# Altium project GL3520 4 Ports.PrjPcb
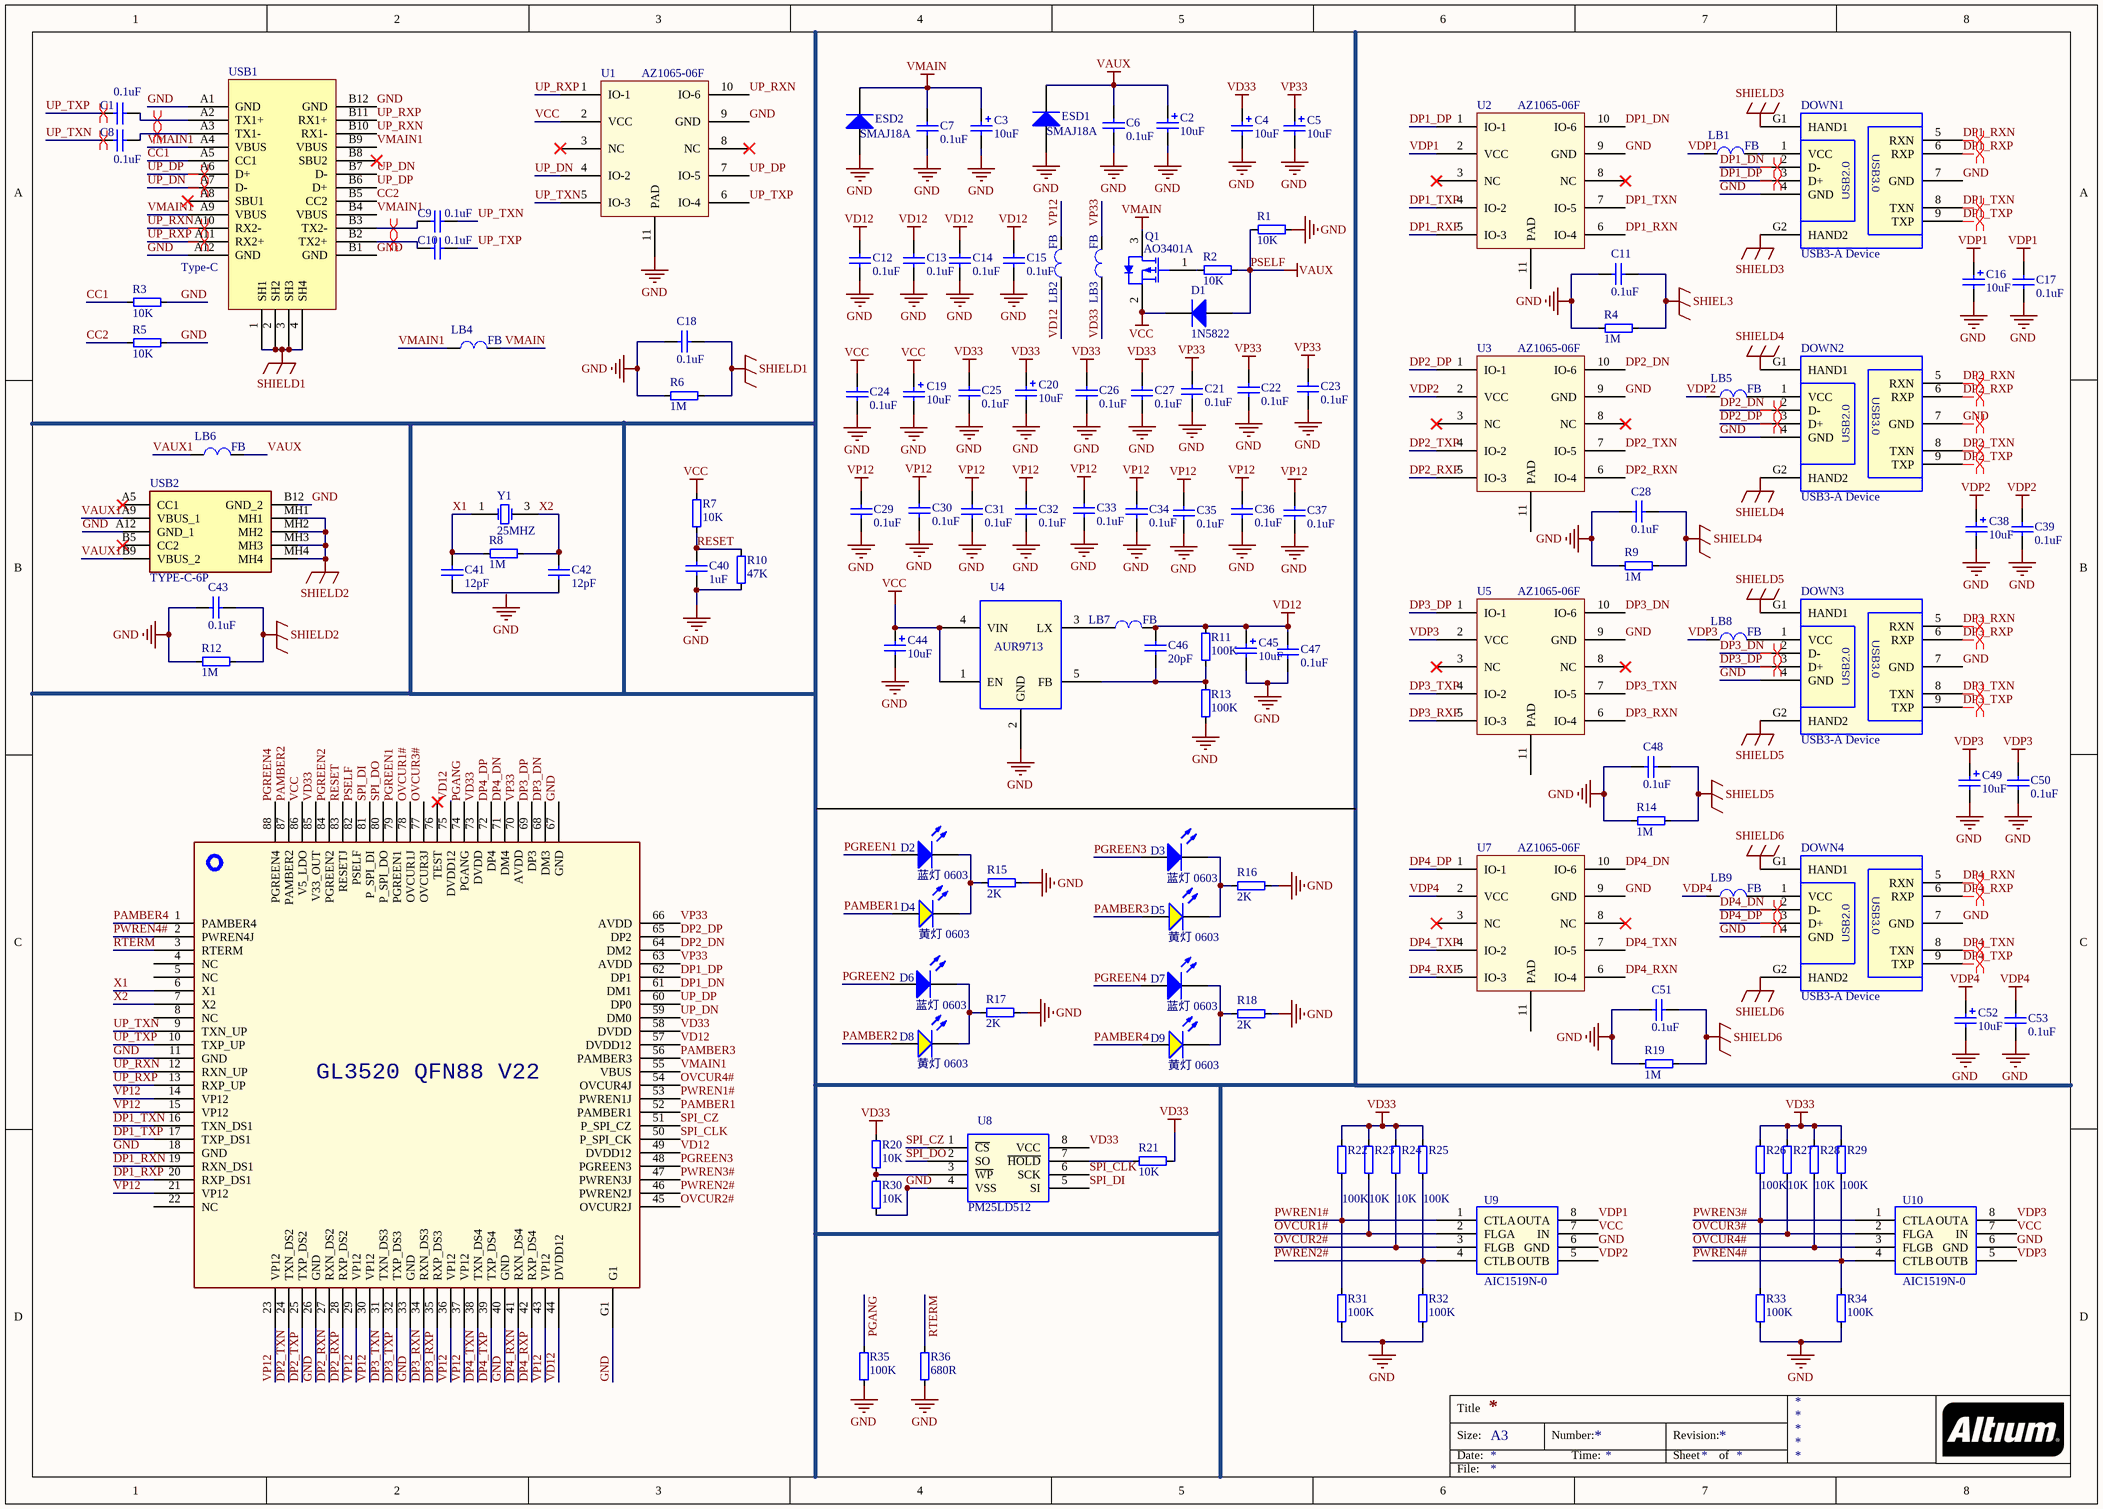
[diagram p0: GL3520 4 Ports.SchDoc]
1 sheet, 127 parts. Net scope: global (net labels, ports and power ports of the same name join across sheets).

## Sheet GL3520 4 Ports.SchDoc
size A3

### Parts
C1  0.1uF  [0603_C]
C2  10uF  [CASE-A_3216]
C3  10uF  [CASE-A_3216]
C4  10uF  [CASE-A_3216]
C5  10uF  [CASE-A_3216]
C6  0.1uF  [0603_C]
C7  0.1uF  [0603_C]
C8  0.1uF  [0603_C]
C9  0.1uF  [0603_C]
C10  0.1uF  [0603_C]
C11  0.1uF  [0603_C]
C12  0.1uF  [0603_C]
C13  0.1uF  [0603_C]
C14  0.1uF  [0603_C]
C15  0.1uF  [0603_C]
C16  10uF  [CASE-A_3216]
C17  0.1uF  [0603_C]
C18  0.1uF  [0603_C]
C19  10uF  [CASE-A_3216]
C20  10uF  [CASE-A_3216]
C21  0.1uF  [0603_C]
C22  0.1uF  [0603_C]
C23  0.1uF  [0603_C]
C24  0.1uF  [0603_C]
C25  0.1uF  [0603_C]
C26  0.1uF  [0603_C]
C27  0.1uF  [0603_C]
C28  0.1uF  [0603_C]
C29  0.1uF  [0603_C]
C30  0.1uF  [0603_C]
C31  0.1uF  [0603_C]
C32  0.1uF  [0603_C]
C33  0.1uF  [0603_C]
C34  0.1uF  [0603_C]
C35  0.1uF  [0603_C]
C36  0.1uF  [0603_C]
C37  0.1uF  [0603_C]
C38  10uF  [CASE-A_3216]
C39  0.1uF  [0603_C]
C40  1uF  [0603_C]
C41  12pF  [0603_C]
C42  12pF  [0603_C]
C43  0.1uF  [0603_C]
C44  10uF  [CASE-A_3216]
C45  10uF  [CASE-A_3216]
C46  20pF  [0603_C]
C47  0.1uF  [0603_C]
C48  0.1uF  [0603_C]
C49  10uF  [CASE-A_3216]
C50  0.1uF  [0603_C]
C51  0.1uF  [0603_C]
C52  10uF  [CASE-A_3216]
C53  0.1uF  [0603_C]
D1  1N5822  [DO-201AD]
D2  蓝灯 0603  [0603_LED_S1]
D3  蓝灯 0603  [0603_LED_S1]
D4  黄灯 0603  [0603_LED_S1]
D5  黄灯 0603  [0603_LED_S1]
D6  蓝灯 0603  [0603_LED_S1]
D7  蓝灯 0603  [0603_LED_S1]
D8  黄灯 0603  [0603_LED_S1]
D9  黄灯 0603  [0603_LED_S1]
DOWN1  USB3-A Device  [CND-USB3-A]
DOWN2  USB3-A Device  [CND-USB3-A]
DOWN3  USB3-A Device  [CND-USB3-A]
DOWN4  USB3-A Device  [CND-USB3-A]
ESD1  SMAJ18A  [VISH-DO-214AC-2_M]
ESD2  SMAJ18A  [VISH-DO-214AC-2_M]
LB1  FB  [LBS-0603]
LB2  FB  [LBS-0603]
LB3  FB  [LBS-0603]
LB4  FB  [LBS-0603]
LB5  FB  [LBS-0603]
LB6  FB  [LBS-0603]
LB7  FB  [LBS-0603]
LB8  FB  [LBS-0603]
LB9  FB  [LBS-0603]
Q1  AO3401A  [AO-SOT-23-3L_V]
R1  10K  [R 0603_L]
R2  10K  [R 0603_L]
R3  10K  [R 0603_L]
R4  1M  [R 0603_L]
R5  10K  [R 0603_L]
R6  1M  [R 0603_L]
R7  10K  [R 0603_L]
R8  1M  [R 0603_L]
R9  1M  [R 0603_L]
R10  47K  [R 0603_L]
R11  100K  [R 0603_L]
R12  1M  [R 0603_L]
R13  100K  [R 0603_L]
R14  1M  [R 0603_L]
R15  2K  [R 0603_L]
R16  2K  [R 0603_L]
R17  2K  [R 0603_L]
R18  2K  [R 0603_L]
R19  1M  [R 0603_L]
R20  10K  [R 0603_L]
R21  10K  [R 0603_L]
R22  100K  [R 0603_L]
R23  10K  [R 0603_L]
R24  10K  [R 0603_L]
R25  100K  [R 0603_L]
R26  100K  [R 0603_L]
R27  10K  [R 0603_L]
R28  10K  [R 0603_L]
R29  100K  [R 0603_L]
R30  10K  [R 0603_L]
R31  100K  [R 0603_L]
R32  100K  [R 0603_L]
R33  100K  [R 0603_L]
R34  100K  [R 0603_L]
R35  100K  [R 0603_L]
R36  680R  [R 0603_L]
U1  AZ1065-06F
U2  AZ1065-06F
U3  AZ1065-06F
U4  AUR9713  [I-TSOT23-5P-2_9x1_6x0_95A]
U5  AZ1065-06F
U6  GL3520_QFN88_V094-1_22  [I-LQFP128-0_4A]  (value not drawn)
U7  AZ1065-06F
U8  PM25LD512  [I-SOP8-1_27A]
U9  AIC1519N-0  [I-SOP8-1_27A]
U10  AIC1519N-0  [I-SOP8-1_27A]
USB1  Type-C  [PCBComponent_1]
USB2  TYPE-C-6P  [TYPEC 6P]
Y1  25MHZ  [SMD-3225_4P]

### Nets
GND: C2.2 C3.2 C4.2 C5.2 C6.1 C7.1 C11.1 C12.1 C13.1 C14.1 C15.1 C16.2 C17.1 C18.1 C19.2 C20.2 C21.1 C22.1 C23.1 C24.1 C25.1 C26.1 C27.1 C28.1 C29.1 C30.1 C31.1 C32.1 C33.1 C34.1 C35.1 C36.1 C37.1 C38.2 C39.1 C40.1 C43.1 C44.2 C45.2 C47.1 C48.1 C49.2 C50.1 C51.1 C52.2 C53.1 DOWN1.4(GND) DOWN1.7(GND) DOWN2.4(GND) DOWN2.7(GND) DOWN3.4(GND) DOWN3.7(GND) DOWN4.4(GND) DOWN4.7(GND) ESD1.2(A) ESD2.2(A) R1.2 R3.2 R4.2 R5.2 R6.2 R9.2 R10.1 R12.2 R13.2 R14.2 R15.1 R16.1 R17.1 R18.1 R19.2 R30.2 R31.2 R32.2 R33.2 R34.2 R35.2 R36.2 U1.9(GND) U1.11(PAD) U2.9(GND) U3.9(GND) U4.2(GND) U5.9(GND) U6.11(GND) U6.18(GND) U6.26(GND) U6.33(GND) U6.40(GND) U6.67(GND) U6.G1 U7.9(GND) U8.4(VSS) U9.6(GND) U10.6(GND) USB1.A1(GND) USB1.A12(GND) USB1.B1(GND) USB1.B12(GND) USB2.A12(GND_1) USB2.B12(GND_2)
PSELF: C2.1 C6.2 D1.1(A) ESD1.1(K) LB6.2 R1.1 R2.2 U6.82(PSELF)  [also labelled VAUX]
SHIEL3: C11.2 R4.1
SHIELD1: C18.2 R6.1 USB1.1(SH1) USB1.2(SH2) USB1.3(SH3) USB1.4(SH4)
SHIELD2: C43.2 R12.1 USB2.MH1 USB2.MH2 USB2.MH3 USB2.MH4
SHIELD3: DOWN1.G1(HAND1) DOWN1.G2(HAND2)
SHIELD4: C28.2 DOWN2.G1(HAND1) DOWN2.G2(HAND2) R9.1
SHIELD5: C48.2 DOWN3.G1(HAND1) DOWN3.G2(HAND2) R14.1
SHIELD6: C51.2 DOWN4.G1(HAND1) DOWN4.G2(HAND2) R19.1
VCC: C19.1 C24.2 C44.1 D1.2(K) Q1.2(SOURCE) R7.2 U1.2(VCC) U4.1(EN) U4.4(VIN) U6.86(V5_LDO) U9.7(IN) U10.7(IN)
VD12: C12.2 C13.2 C14.2 C15.2 C45.1 C46.2 C47.2 LB2.1 LB7.2 R11.1 U6.44(DVDD12) U6.49(DVDD12) U6.57(DVDD12) U6.75(DVDD12)
VD33: C4.1 C20.1 C25.2 C26.2 C27.2 LB3.1 R20.1 R21.2 R22.1 R23.1 R24.1 R25.1 R26.1 R27.1 R28.1 R29.1 U6.58(DVDD) U6.73(DVDD) U6.85(V33_OUT) U8.8(VCC)
VDP1: C16.1 C17.2 LB1.1 U2.2(VCC) U9.8(OUTA)
VDP2: C38.1 C39.2 LB5.1 U3.2(VCC) U9.5(OUTB)
VDP3: C49.1 C50.2 LB8.1 U5.2(VCC) U10.5(OUTB) U10.8(OUTA)
VDP4: C52.1 C53.2 LB9.1 U7.2(VCC)
VMAIN: C3.1 C7.2 ESD2.1(K) LB4.2 Q1.3(DRAIN)
VP12: C29.2 C30.2 C31.2 C32.2 C33.2 C34.2 C35.2 C36.2 C37.2 LB2.2 U6.14(VP12) U6.15(VP12) U6.21(VP12) U6.23(VP12) U6.29(VP12) U6.30(VP12) U6.36(VP12) U6.37(VP12) U6.43(VP12)
VP33: C5.1 C21.2 C22.2 C23.2 LB3.2 U6.63(AVDD) U6.66(AVDD) U6.70(AVDD)
CC1: R3.1 USB1.A5(CC1)
CC2: R5.1 USB1.B5(CC2)
DP1_DN: DOWN1.2(D-) U2.10(IO-6) U6.61(DM1)
DP1_DP: DOWN1.3(D+) U2.1(IO-1) U6.62(DP1)
DP1_RXN: DOWN1.5(RXN) U2.6(IO-4) U6.19(RXN_DS1)
DP1_RXP: DOWN1.6(RXP) U2.5(IO-3) U6.20(RXP_DS1)
DP1_TXN: DOWN1.8(TXN) U2.7(IO-5) U6.16(TXN_DS1)
DP1_TXP: DOWN1.9(TXP) U2.4(IO-2) U6.17(TXP_DS1)
DP2_DN: DOWN2.2(D-) U3.10(IO-6) U6.64(DM2)
DP2_DP: DOWN2.3(D+) U3.1(IO-1) U6.65(DP2)
DP2_RXN: DOWN2.5(RXN) U3.6(IO-4) U6.27(RXN_DS2)
DP2_RXP: DOWN2.6(RXP) U3.5(IO-3) U6.28(RXP_DS2)
DP2_TXN: DOWN2.8(TXN) U3.7(IO-5) U6.24(TXN_DS2)
DP2_TXP: DOWN2.9(TXP) U3.4(IO-2) U6.25(TXP_DS2)
DP3_DN: DOWN3.2(D-) U5.10(IO-6) U6.68(DM3)
DP3_DP: DOWN3.3(D+) U5.1(IO-1) U6.69(DP3)
DP3_RXN: DOWN3.5(RXN) U5.6(IO-4) U6.34(RXN_DS3)
DP3_RXP: DOWN3.6(RXP) U5.5(IO-3) U6.35(RXP_DS3)
DP3_TXN: DOWN3.8(TXN) U5.7(IO-5) U6.31(TXN_DS3)
DP3_TXP: DOWN3.9(TXP) U5.4(IO-2) U6.32(TXP_DS3)
DP4_DN: DOWN4.2(D-) U6.71(DM4) U7.10(IO-6)
DP4_DP: DOWN4.3(D+) U6.72(DP4) U7.1(IO-1)
DP4_RXN: DOWN4.5(RXN) U6.41(RXN_DS4) U7.6(IO-4)
DP4_RXP: DOWN4.6(RXP) U6.42(RXP_DS4) U7.5(IO-3)
DP4_TXN: DOWN4.8(TXN) U6.38(TXN_DS4) U7.7(IO-5)
DP4_TXP: DOWN4.9(TXP) U6.39(TXP_DS4) U7.4(IO-2)
OVCUR1#: R23.2 U6.78(OVCUR1J) U9.2(FLGA)
OVCUR2#: R24.2 U6.45(OVCUR2J) U9.3(FLGB)
OVCUR3#: R27.2 U6.77(OVCUR3J) U10.2(FLGA)
OVCUR4#: R28.2 U6.54(OVCUR4J) U10.3(FLGB)
PAMBER1: D4.A U6.52(PAMBER1)
PAMBER2: D8.A U6.87(PAMBER2)
PAMBER3: D5.A U6.56(PAMBER3)
PAMBER4: D9.A U6.1(PAMBER4)
PGANG: R35.1 U6.74(PGANG)
PGREEN1: D2.A U6.79(PGREEN1)
PGREEN2: D6.A U6.84(PGREEN2)
PGREEN3: D3.A U6.48(PGREEN3)
PGREEN4: D7.A U6.88(PGREEN4)
PWREN1#: R22.2 R31.1 U6.53(PWREN1J) U9.1(CTLA)
PWREN2#: R25.2 R32.1 U6.46(PWREN2J) U9.4(CTLB)
PWREN3#: R26.2 R33.1 U6.47(PWREN3J) U10.1(CTLA)
PWREN4#: R29.2 R34.1 U6.2(PWREN4J) U10.4(CTLB)
RESET: C40.2 R7.1 R10.2 U6.83(RESETJ)
RTERM: R36.1 U6.3(RTERM)
SPI_CLK: U6.50(P_SPI_CK) U8.6(SCK)
SPI_CZ: U6.51(P_SPI_CZ) U8.1(~{CS})
SPI_DI: U6.81(P_SPI_DI) U8.5(SI)
SPI_DO: U6.80(P_SPI_DO) U8.2(SO)
UP_DN: U1.4(IO-2) U6.59(DM0) USB1.A7(D-) USB1.B7(D-)
UP_DP: U1.7(IO-5) U6.60(DP0) USB1.A6(D+) USB1.B6(D+)
UP_RXN: U1.10(IO-6) U6.12(RXN_UP) USB1.A10(RX2-) USB1.B10(RX1-)
UP_RXP: U1.1(IO-1) U6.13(RXP_UP) USB1.A11(RX2+) USB1.B11(RX1+)
UP_TXN: C8.2 C9.1 U1.5(IO-3) U6.9(TXN_UP)
UP_TXP: C1.2 C10.1 U1.6(IO-4) U6.10(TXP_UP)
VAUX1: LB6.1 USB2.A9(VBUS_1) USB2.B9(VBUS_2)
VMAIN1: LB4.1 U6.55(VBUS) USB1.A4(VBUS) USB1.A9(VBUS) USB1.B4(VBUS) USB1.B9(VBUS)
X1: C41.2 R8.1 U6.6(X1) Y1.1(OSC1)
X2: C42.2 R8.2 U6.7(X2) Y1.3(OSC2)
NetC1_1: C1.1 USB1.A2(TX1+)
NetC8_1: C8.1 USB1.A3(TX1-)
NetC9_2: C9.2 USB1.B3(TX2-)
NetC10_2: C10.2 USB1.B2(TX2+)
NetC41_1: C41.1 C42.1
NetC46_1: C46.1 R11.2 R13.1 U4.5(FB)
NetD2_K: D2.K D4.K R15.2
NetD3_K: D3.K D5.K R16.2
NetD6_K: D6.K D8.K R17.2
NetD7_K: D7.K D9.K R18.2
NetDOWN1_1: DOWN1.1(VCC) LB1.2
NetDOWN2_1: DOWN2.1(VCC) LB5.2
NetDOWN3_1: DOWN3.1(VCC) LB8.2
NetDOWN4_1: DOWN4.1(VCC) LB9.2
NetLB7_1: LB7.1 U4.3(LX)
NetQ1_1: Q1.1(GATE) R2.1
NetR20_2: R20.2 R30.1 U8.3(~{WP})
NetR21_1: R21.1 U8.7(~{HOLD})

Not connected (* = marked no-connect by the designer): U1 3(NC)* 8(NC)*; U2 3(NC)* 8(NC)* 11(PAD); U3 3(NC)* 8(NC)* 11(PAD); U5 3(NC)* 8(NC)* 11(PAD); U6 4(NC) 5(NC) 8(NC) 22(NC) 76(TEST)*; U7 3(NC)* 8(NC)* 11(PAD); USB1 A8(SBU1)* B8(SBU2)*; USB2 A5(CC1)* B5(CC2)*

### Layout directives
differential pair: DP1_DN, DP1_DP, DP1_RXN, DP1_RXP, DP1_TXN, DP1_TXP, DP2_DN, DP2_DP, DP2_RXN, DP2_RXP, DP2_TXN, DP2_TXP, DP3_DN, DP3_DP, DP3_RXN, DP3_RXP, DP3_TXN, DP3_TXP, DP4_DN, DP4_DP, DP4_RXN, DP4_RXP, DP4_TXN, DP4_TXP, GND, NetC1_1, NetC8_1, NetC9_2, NetC10_2, UP_DN, UP_DP, UP_RXN, UP_RXP, UP_TXN, UP_TXP

### Notes on the sheet
- Labels drawn without touching a wire or pin: GND
- Title
- Size:
- Date:
- A3
- Number:
- Time:
- Revision:
- Sheet
- of
- File:
- (in symbol GL3520_QFN88_V094-1_22) GL3520 QFN88 V22
- (in symbol USB3-A_5) USB3.0; USB2.0

### Library data of the parts
C1 C6-C15 C17 C18 C21-C37 C39-C43 C46-C48 C50 C51 C53 = 0603 2.2uF (225) 10% 16V: 贴片电容; ComponentLink1Description: 供应商链接; ComponentLink1URL: http://www.szlcsc.com/product/details_24366.html; Package: 0603; Supplier: LC; SuppliersPartNumber: C23630
C2 C3 C19 C20 = 3216 10uF (106) 10% 16V: 钽电容1206; ComponentLink1Description: 供应商链接; ComponentLink1URL: http://www.szlcsc.com/product/details_7643.html; Package: 3216; Supplier: LC; SuppliersPartNumber: C7171
C4 C5 C16 C38 C44 C45 C49 C52 = 3216 10uF (106) 10% 16V: 钽电容; ComponentLink1Description: 供应商链接; ComponentLink1URL: http://www.szlcsc.com/product/details_7643.html; Package: 3216; Supplier: LC; SuppliersPartNumber: C7171
D1 = Diode 1N5400: 3 Amp General Purpose Rectifier; Published: 8-Jun-2000; LatestRevisionDate: 17-Jul-2002; LatestRevisionNote: Re-released for DXP Platform.; DatasheetVersion: 1998; PackageVersion: Aug-1999; PackageReference: DO-201AD; Publisher: Altium Limited; PackageDescription: Diode, Axial; Body 9.5 x 5.6 mm (LxDia. max), Lead Dia. 1.32 mm (max); ComponentLink1Description: Manufacturer Link; ComponentLink1URL: http://www.fairchildsemi.com/; ComponentLink2Description: Datasheet; ComponentLink2URL: http://www.fairchildsemi.com/ds/1N%2F1N5400.pdf
D2 D3 D6 D7 = 0603 蓝灯: 发光二极管; ComponentLink1Description: 供应商链接; ComponentLink1URL: http://www.szlcsc.com/product/details_73150.html; Package: 0603; Supplier: LC; SuppliersPartNumber: C72041
D4 D5 D8 D9 = 0603 黄灯: 发光二极管; ComponentLink1Description: 供应商链接; ComponentLink1URL: http://www.szlcsc.com/product/details_73147.html; Package: 0603; Supplier: LC; SuppliersPartNumber: C72038
DOWN1-DOWN4 = USB3-A_5: PCB Footprint: CND-USB3A-A
ESD1 ESD2 = CMP-0548-00315-2: Transient Voltage Suppressor, 6.40 to 231 V, 12 V Stand-off Voltage, Uni-Directional, -55 to 155 degC, 2-pin DO-214AC, Pb-Free, Tape and Reel; PartNumber: SMAJ12A-E3/5A; Manufacturer: Vishay Semiconductor; IFSM: 40 A; ID (uA): 1; VBR Uni-Directional (V): 6.4 to 231; PPPM (W): 400, 300; VWM (V): 12; ComponentLink2URL: http://www.vishay.com/docs/88390/smaj50a.pdf; Packing: Tape and Reel; DatasheetVersion: 12/8/2013; Operating Junction and Storage Temperature Range: -55 to 150 degC; Mounting Technology: Surface Mount; PackageDescription: 2-Pin DO-214AC (SMA), Body 4.245 x 2.665 mm; ComponentLink1URL: http://www.vishay.com/; ComponentLink3Description: Package Specification; PackageReference: DO-214AC-2; ComponentLink1Description: Manufacturer URL; ComponentLink2Description: Datasheet; RoHS: TRUE; ComponentLink3URL: http://www.vishay.com/docs/88390/smaj50a.pdf
LB1-LB9 = L-0603: PCB Footprint: LBS-0603
Q1 = CMP-2000-05778-1: P-Channel MOSFET, 30 V, 4 A, -55 to 150 degC, 3-Pin SOT-23-3L, RoHS, Tape and Reel; Manufacturer: Alpha and Omega; Output Power (Max): NotRequiredW; Power Dissipation: 1.4W; Rad Hardened: No; Drain Efficiency: NotRequired%; Drain-Source On-Volt: 30V; Noise Figure: NotRequireddB; Frequency (Max): NotRequiredMHz; Number of  Elements: 1; Gate-Source Voltage (Max): ?12V; Drain Current (Max): 4A; Channel Mode: Enhancement; Drain-Source On-Res: 0.044ohm; Type: PowerMOSFET; Polarity: P; Package URL: http://www.aosmd.com/res/packaging_information/SOT-23-3L.pdf; Datasheet URL: http://www.aosmd.com/res/data_sheets/AO3401A.pdf; Package Type: SOT-23; Package Description: 3-Pin Small Outline Transistor, Body 2.95 x 1.6 mm, Pitch 0.95 mm; Mounting: SurfaceMount; Manufacturer URL: http://www.aosmd.com/; Continuous Drain Current: 4A; Package Reference: SOT-23-3L; Mounting Technology: SurfaceMount; Operating Temperature Classification: Military; Power Gain: NotRequireddB; Datasheet Version: Rev. 3, 03/2011; Operating Temp Range: -55Cto150C; Pin Count: 3
R1-R36 = RES
U1-U3 U5 U7 = AZ1065-06F: 晶炎AZ1065-06F.R7G DFN4120 丝印119 ESD/TVS静电保护二极管
U4 = AUR9705_3: PCB Footprint: I-TSOT23-5P-2_9x1_6x0_95A
U8 = CAT25C128/256: PCB Footprint: I-SOP8-1_27A
U9 U10 = AIC1526-SOP: PCB Footprint: I-SOP8-1_27A
USB2 = TYPE-C-31-M-17: Connector; Manufacturer_Name: Korean Hroparts Elec; Datasheet Link: https://datasheet.lcsc.com/szlcsc/1903211732_Korean-Hroparts-Elec-TYPE-C-31-M-17_C283540.pdf; Height: 3.26mm; Manufacturer_Part_Number: TYPE-C-31-M-17; Arrow Part Number: TYPE-C-31-M-17
Y1 = SMD-3225_4P  25MHZ 12PF 10PPM: 贴片晶振; ComponentLink1Description: 供应商链接; ComponentLink1URL: http://www.szlcsc.com/product/details_9526.html; Package: SMD-3225_4P; Supplier: LC; SuppliersPartNumber: C9006